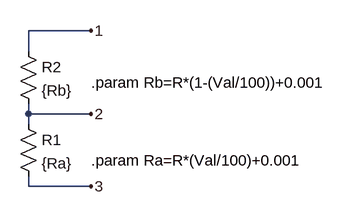
[diagram p0: schematic pot.asc]
pot.asc, the LTspice schematic file:
Version 4
SHEET 1 880 680
WIRE 272 48 176 48
WIRE 176 80 176 48
WIRE 176 176 176 160
WIRE 272 176 176 176
WIRE 176 192 176 176
WIRE 176 288 176 272
WIRE 272 288 176 288
FLAG 272 48 1
FLAG 272 176 2
FLAG 272 288 3
SYMBOL res 160 176 R0
SYMATTR InstName R1
SYMATTR Value {Ra}
SYMBOL res 160 64 R0
SYMATTR InstName R2
SYMATTR Value {Rb}
TEXT 272 248 Left 2 !.param Ra=R*(Val/100)+0.001
TEXT 272 128 Left 2 !.param Rb=R*(1-(Val/100))+0.001

The netlist it stands for:
* pot.asc
R1 2 3 {Ra}
R2 1 2 {Rb}
.param Ra=R*(Val/100)+0.001
.param Rb=R*(1-(Val/100))+0.001
.backanno
.end